# Altium schematic sheet MCU.SchDoc
size A4
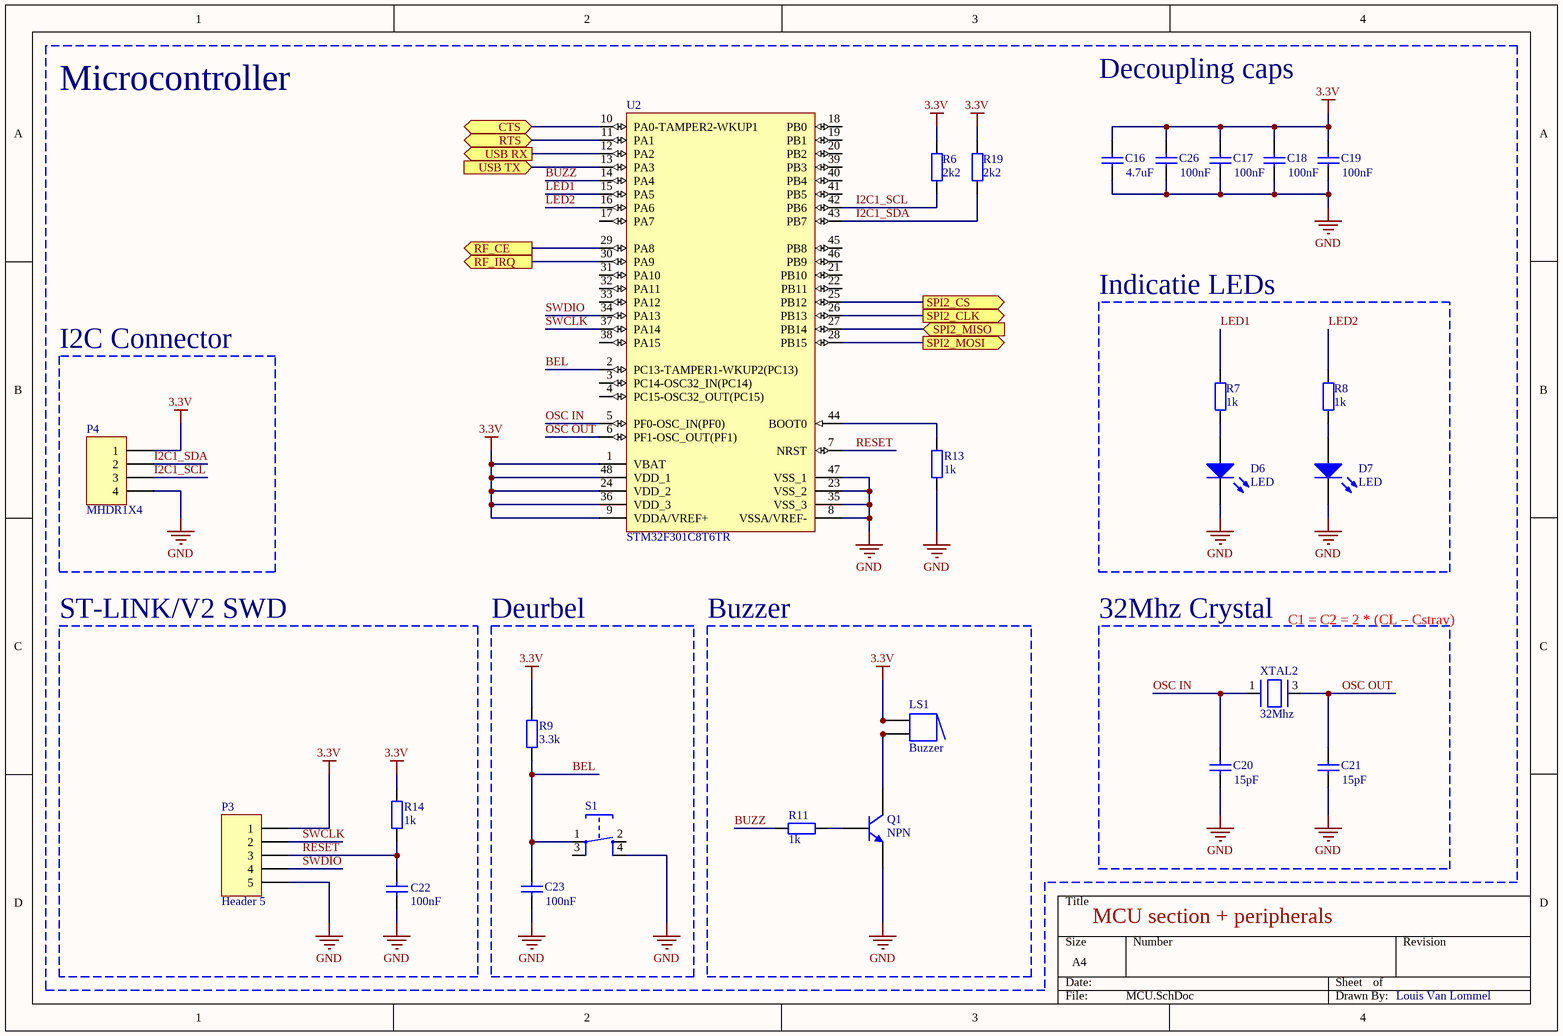
[diagram p0: MCU.SchDoc]

## Parts
C16  value 4.7uF  [CAP_0603]
C17  value 100nF  [CAP_0603]
C18  value 100nF  [CAP_0603]
C19  value 100nF  [CAP_0603]
C20  value 15pF  [CAP_0603]
C21  value 15pF  [CAP_0603]
C22  value 100nF  [CAP_0603]
C23  value 100nF  [CAP_0603]
C26  value 100nF  [CAP_0603]
D6  LED  [LED_0603]
D7  LED  [LED_0603]
LS1  Buzzer  [Buzzer]
P3  Header 5  [HDR1X5]
P4  MHDR1X4  [MHDR1X4]
Q1  NPN  [SOT23_L]
R6  value 2k2  [RES_0603]
R7  value 1k  [RES_0603]
R8  value 1k  [RES_0603]
R9  value 3.3k  [RES_0603]
R11  value 1k  [RES_0603]
R13  value 1k  [RES_0603]
R14  value 1k  [RES_0603]
R19  value 2k2  [RES_0603]
S1  (no value)  [TactileSwitch6x6]
U2  STM32F301C8T6TR  [STM-LQFP48_M]
XTAL2  32Mhz  [16Mhz_Crystal]

## Blocks framed on the sheet
Indicatie LEDs: D6 D7 R7 R8
I2C Connector: P4
ST-LINK/V2 SWD: C22 P3 R14
Deurbel: C23 R9 S1
Buzzer: LS1 Q1 R11
32Mhz Crystal: C20 C21 XTAL2

## Ports
CTS (bidir), RF_CE (out), RF_IRQ (out), RTS (bidir), SPI2_CLK (out), SPI2_CS (out), SPI2_MISO (in), SPI2_MOSI (out), USB RX (out), USB TX (in)

## Nets
3.3V: C16.2 C17.2 C18.2 C19.2 C26.2 LS1.1 LS1.1A P3.1 P4.1 R6.2 R9.1 R14.1 R19.2 U2.1(VBAT) U2.9(VDDA/VREF+) U2.24(VDD_2) U2.36(VDD_3) U2.48(VDD_1)
GND: C16.1 C17.1 C18.1 C19.1 C20.1 C21.1 C22.1 C23.1 C26.1 D6.2(K) D7.2(K) P3.5 P4.4 Q1.3(E) R13.2 S1.4 U2.8(VSSA/VREF-) U2.23(VSS_2) U2.35(VSS_3) U2.47(VSS_1)
BEL: C23.2 R9.2 S1.1 U2.2(PC13-TAMPER1-WKUP2(PC13))
BUZZ: R11.1 U2.14(PA4)
CTS: U2.10(PA0-TAMPER2-WKUP1) ; port CTS
I2C1_SCL: P4.3 R6.1 U2.42(PB6)
I2C1_SDA: P4.2 R19.1 U2.43(PB7)
LED1: R7.2 U2.15(PA5)
LED2: R8.2 U2.16(PA6)
OSC IN: C20.2 U2.5(PF0-OSC_IN(PF0)) XTAL2.1
OSC OUT: C21.2 U2.6(PF1-OSC_OUT(PF1)) XTAL2.3
RESET: C22.2 P3.3 R14.2 U2.7(NRST)
RF_CE: U2.29(PA8) ; port RF_CE
RF_IRQ: U2.30(PA9) ; port RF_IRQ
RTS: U2.11(PA1) ; port RTS
SPI2_CLK: U2.26(PB13) ; port SPI2_CLK
SPI2_CS: U2.25(PB12) ; port SPI2_CS
SPI2_MISO: U2.27(PB14) ; port SPI2_MISO
SPI2_MOSI: U2.28(PB15) ; port SPI2_MOSI
SWCLK: P3.2 U2.37(PA14)
SWDIO: P3.4 U2.34(PA13)
USB RX: U2.12(PA2) ; port USB RX
USB TX: U2.13(PA3) ; port USB TX
NetD6_1: D6.1(A) R7.1
NetD7_1: D7.1(A) R8.1
NetLS1_2: LS1.2 LS1.2A Q1.1(C)
NetQ1_2: Q1.2(B) R11.2
NetR13_1: R13.1 U2.44(BOOT0)

Not connected (* = marked no-connect by the designer): S1 2 3; U2 3(PC14-OSC32_IN(PC14)) 4(PC15-OSC32_OUT(PC15)) 17(PA7) 18(PB0) 19(PB1) 20(PB2) 21(PB10) 22(PB11) 31(PA10) 32(PA11) 33(PA12) 38(PA15) 39(PB3) 40(PB4) 41(PB5) 45(PB8) 46(PB9)

## Notes on the sheet
- Microcontroller
- Decoupling caps
- C1 = C2 = 2 * (CL – Cstray)
- MCU section + peripherals
- Louis Van Lommel

## Library data of the parts
C16-C23 C26 = Cap: Capacitor; Published: 8-Jun-2000; LatestRevisionDate: 17-Jul-2002; LatestRevisionNote: Re-released for DXP Platform.; PackageReference: RAD-0.3; Publisher: Altium Limited; PackageDescription: Radial Cap, Thru-Hole; 2 Leads; 0.3 in Pin Spacing
D6 D7 = LED2: Typical RED, GREEN, YELLOW, AMBER GaAs LED; Published: 8-Jun-2000; LatestRevisionDate: 17-Jul-2002; LatestRevisionNote: Re-released for DXP Platform.; PackageVersion: Feb-2002; PackageReference: 3.2X1.6X1.1; Publisher: Altium Limited; PackageDescription: SM LED; 2 Flat Leads
LS1 = Buzzer: Magnetic Transducer Buzzer; Published: 24-Mar-1999; LatestRevisionDate: 17-Dec-2003; LatestRevisionNote: Schematic revised, PCB Footprint replaced.; DatasheetVersion: 17-Dec-2003; PackageReference: ABSM-1574; Publisher: Altium Limited; PackageDescription: Magnetic Transducer Buzzer; ComponentLink1Description: Manufacturer Link; ComponentLink1URL: http://www.megastar.com/linecard/buzzmode/index.php
P3 = Header 5: Header, 5-Pin; LatestRevisionDate: 17-Jul-2002; LatestRevisionNote: Re-released for DXP Platform.; Publisher: Altium Limited
P4 = MHDR1X4: Header, 4-Pin; LatestRevisionDate: 17-Jul-2002; LatestRevisionNote: Re-released for DXP Platform.; Publisher: Altium Limited
Q1 = NPN: NPN Bipolar Transistor; Published: 8-Jun-2000; LatestRevisionDate: 17-Jul-2002; LatestRevisionNote: Re-released for DXP Platform.; PackageReference: TO-226-AA; Publisher: Altium Limited; PackageDescription: TO, Flat Index; 3 In-Line, Axial Leads; Body Dia. 4.8mm; Leads 0.55 x 0.51 mm (max); Code_JEDEC: TO-226-AA
R6-R9 R11 R13 R14 R19 = Res2: Resistor; Published: 8-Jun-2000; LatestRevisionDate: 17-Jul-2002; LatestRevisionNote: Re-released for DXP Platform.; PackageReference: AXIAL-0.4; Publisher: Altium Limited; PackageDescription: Axial Device, Thru-Hole; 2 Leads; 0.4 in Pin Spacing
S1 = Tactile Switch: gekruisde schakelaar (1.4 en 2.3)
U2 = CMP-0537-00001-2: ARM Cortex-M4 32-bit MCU, 64 KB Flash, 16 KB Internal RAM, 37 I/Os, 48-Pin LQFP, -40 to 85 degC, Tape and Reel; FLASH Size (Prog) (kB): 64; Internal RAM Size (kB): 16; D/A Converter: 1; Operating Frequency(F) (Processor speed) (MHz): 72; Supply Voltage(Vcc) min (V): 2; I/Os (High Current): 37; ComponentLink2Description: Datasheet; ComponentLink1URL: http://www.st.com/; Package Description: 48-Pin Low Profile Quad Flat Package, Body 7 x 7 mm, Pitch 0.5 mm; ComponentLink1Description: Manufacturer URL; ComponentLink2URL: http://www.st.com/st-web-ui/static/active/en/resource/technical/document/datasheet/DM00093332.pdf; Mounting Technology: Surface Mount; Packing: Tape and Reel; DatasheetVersion: Rev. 6; Package Reference: LQFP48; Core: ARM Cortex-M4
XTAL2 = Crystal: Crystal, 16 MHz, SMD, 3.2mm x 2.5mm, 30 ppm, 18 pF, 30 ppm, 7M